# Altium schematic sheet USBtoUART.SchDoc
size A; SheetNumber: 4; SheetTotal: 5
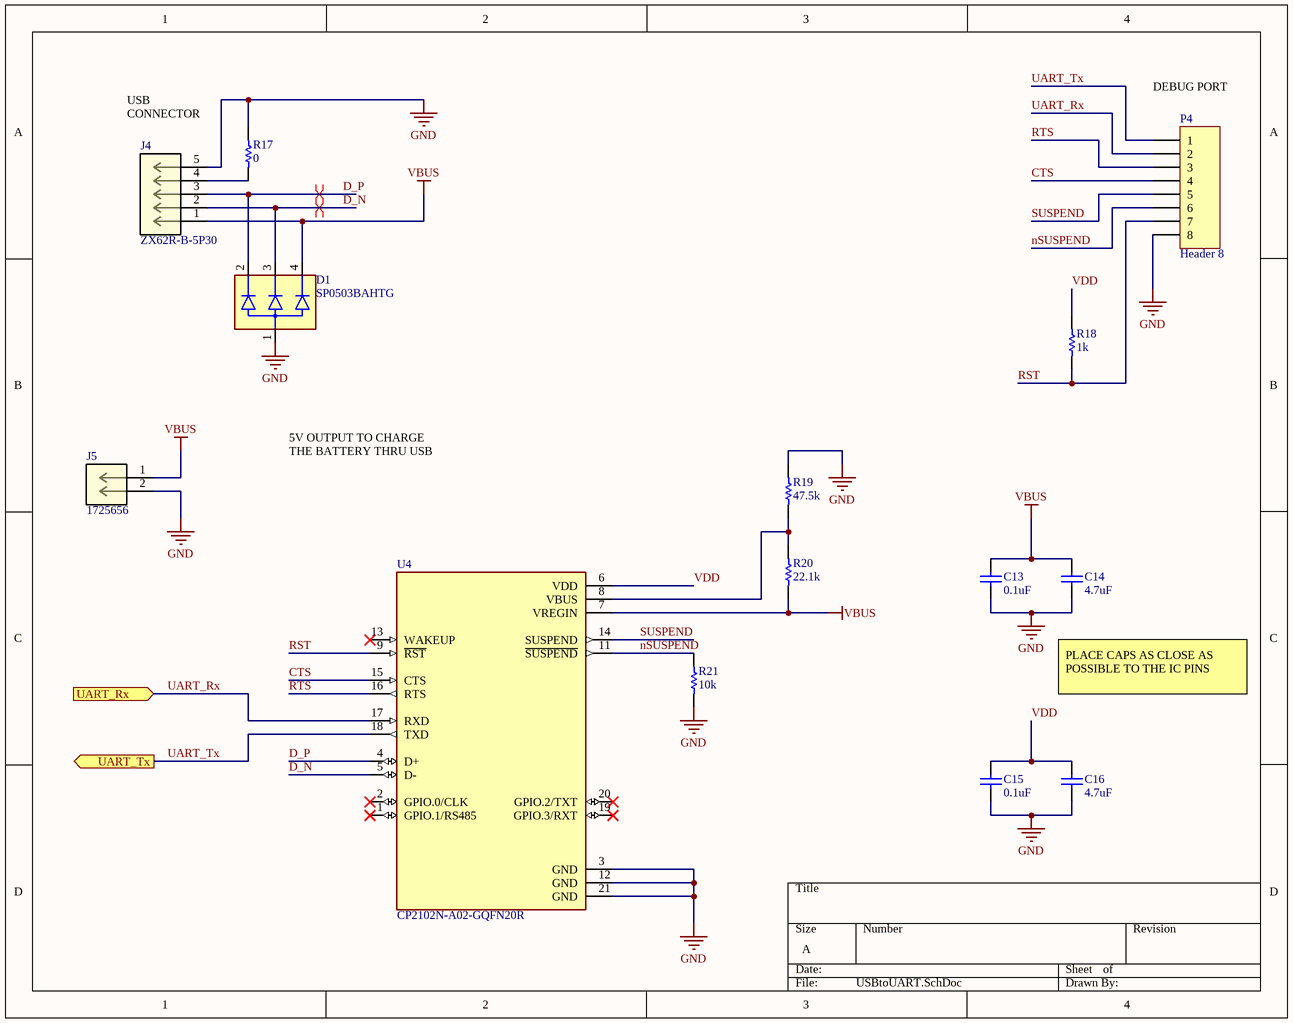
[diagram p0: USBtoUART.SchDoc]

## Parts
C13  value 0.1uF  [0402cap]  (hidden comment: C0402)
C14  value 4.7uF  [0805CAP]  (hidden comment: C0805)
C15  value 0.1uF  [0402cap]  (hidden comment: C0402)
C16  value 4.7uF  [0805CAP]  (hidden comment: C0805)
D1  SP0503BAHTG  [SOT143]
J4  ZX62R-B-5P30  [CONN_ZX62R-B-5P30_HIR]
J5  1725656  [CONN_1725656_PXC]
P4  Header 8  [HDR1X8]
R17  value 0  [0805RES]  (hidden comment: R0805)
R18  value 1k  [0402RES]  (hidden comment: R0402)
R19  value 47.5k  [0805RES]  (hidden comment: R0805)
R20  value 22.1k  [0805RES]  (hidden comment: R0805)
R21  value 10k  [0402RES]  (hidden comment: R0402)
U4  CP2102N-A02-GQFN20R  [SILABS_CP2102N-A02-GQFN20R]

## Ports
UART_Rx (in), UART_Tx (out)

## Nets
GND: C13.1 C14.1 C15.1 C16.1 D1.1 J4.5 J5.2 P4.8 R17.2 R19.2 R21.1 U4.3(GND) U4.12(GND) U4.21(GND)
VBUS: C13.2 C14.2 D1.4 J4.1 J5.1 R20.1 U4.7(VREGIN)
CTS: P4.4 U4.15(CTS)
D_N: D1.3 J4.2 U4.5(D-)
D_P: D1.2 J4.3 U4.4(D+)
nSUSPEND: P4.6 R21.2 U4.11(~{SUSPEND})
RST: P4.7 R18.1 U4.9(~{RST})
RTS: P4.3 U4.16(RTS)
SUSPEND: P4.5 U4.14(SUSPEND)
UART_Rx: P4.2 U4.17(RXD) ; port UART_Rx
UART_Tx: P4.1 U4.18(TXD) ; port UART_Tx
VDD: C15.2 C16.2 R18.2 U4.6(VDD)
NetJ4_4: J4.4 R17.1
NetR19_1: R19.1 R20.2 U4.8(VBUS)

Not connected (* = marked no-connect by the designer): U4 1(GPIO.1/RS485)* 2(GPIO.0/CLK)* 13(WAKEUP)* 19(GPIO.3/RXT)* 20(GPIO.2/TXT)*

## Layout directives
differential pair: D_N, D_P

## Notes on the sheet
- (near P4) DEBUG PORT
- USB CONNECTOR
- (near D1) Type @ to refer to a designator
- 5V OUTPUT TO CHARGE THE BATTERY THRU USB
- PLACE CAPS AS CLOSE AS POSSIBLE TO THE IC PINS

## Library data of the parts
C13 C15 = C0402: 0402 Ceramic Chip Capacitor - Standard
C14 C16 = C0805: 0805 Ceramic Chip Capacitor - Standard
D1 = SP0503BAHTG: TVS DIODE 5.5VWM 8.5VC SOT143 <a href="https://pricing.snapeda.com/parts/SP0503BAHTG/Littelfuse/view-part?ref=eda">Check availability</a>; MF: {'manufacturer': u'Littelfuse Inc.'}; Package: None; Price: None; Value: *; MP: SP0503BAHTG; Availability: Unavailable
J4 = ZX62R-B-5P30: No Description Available; Mfr_Name: Hirose; RefDes: RefDes; Type: Type
J5 = 1725656: No Description Available; Mfr_Name: Phoenix Contact; RefDes: RefDes; Type: Type
P4 = Header 8: Header, 8-Pin; LatestRevisionDate: 17-Jul-2002; LatestRevisionNote: Re-released for DXP Platform.; Publisher: Altium Limited
R17 R19 R20 = R0805: 0805 Chip Resistor - Standard
R18 R21 = R0402: 0402 Chip Resistor - Standard; ComponentLink1URL: *
U4 = CP2102N-A02-GQFN20R: USB Bridge, USB to UART USB 2.0 UART Interface 20-QFN (3x3); MF: Silicon Labs; SnapEDA_Link: https://www.snapeda.com/parts/CP2102N-A02-GQFN20R/Silicon+Labs/view-part/?ref=snap; Package: None; Value: *; MP: CP2102N-A02-GQFN20R; Check_prices: https://www.snapeda.com/parts/CP2102N-A02-GQFN20R/Silicon+Labs/view-part/?ref=eda